# EAGLE design LEDboard (EAGLE 6.4)
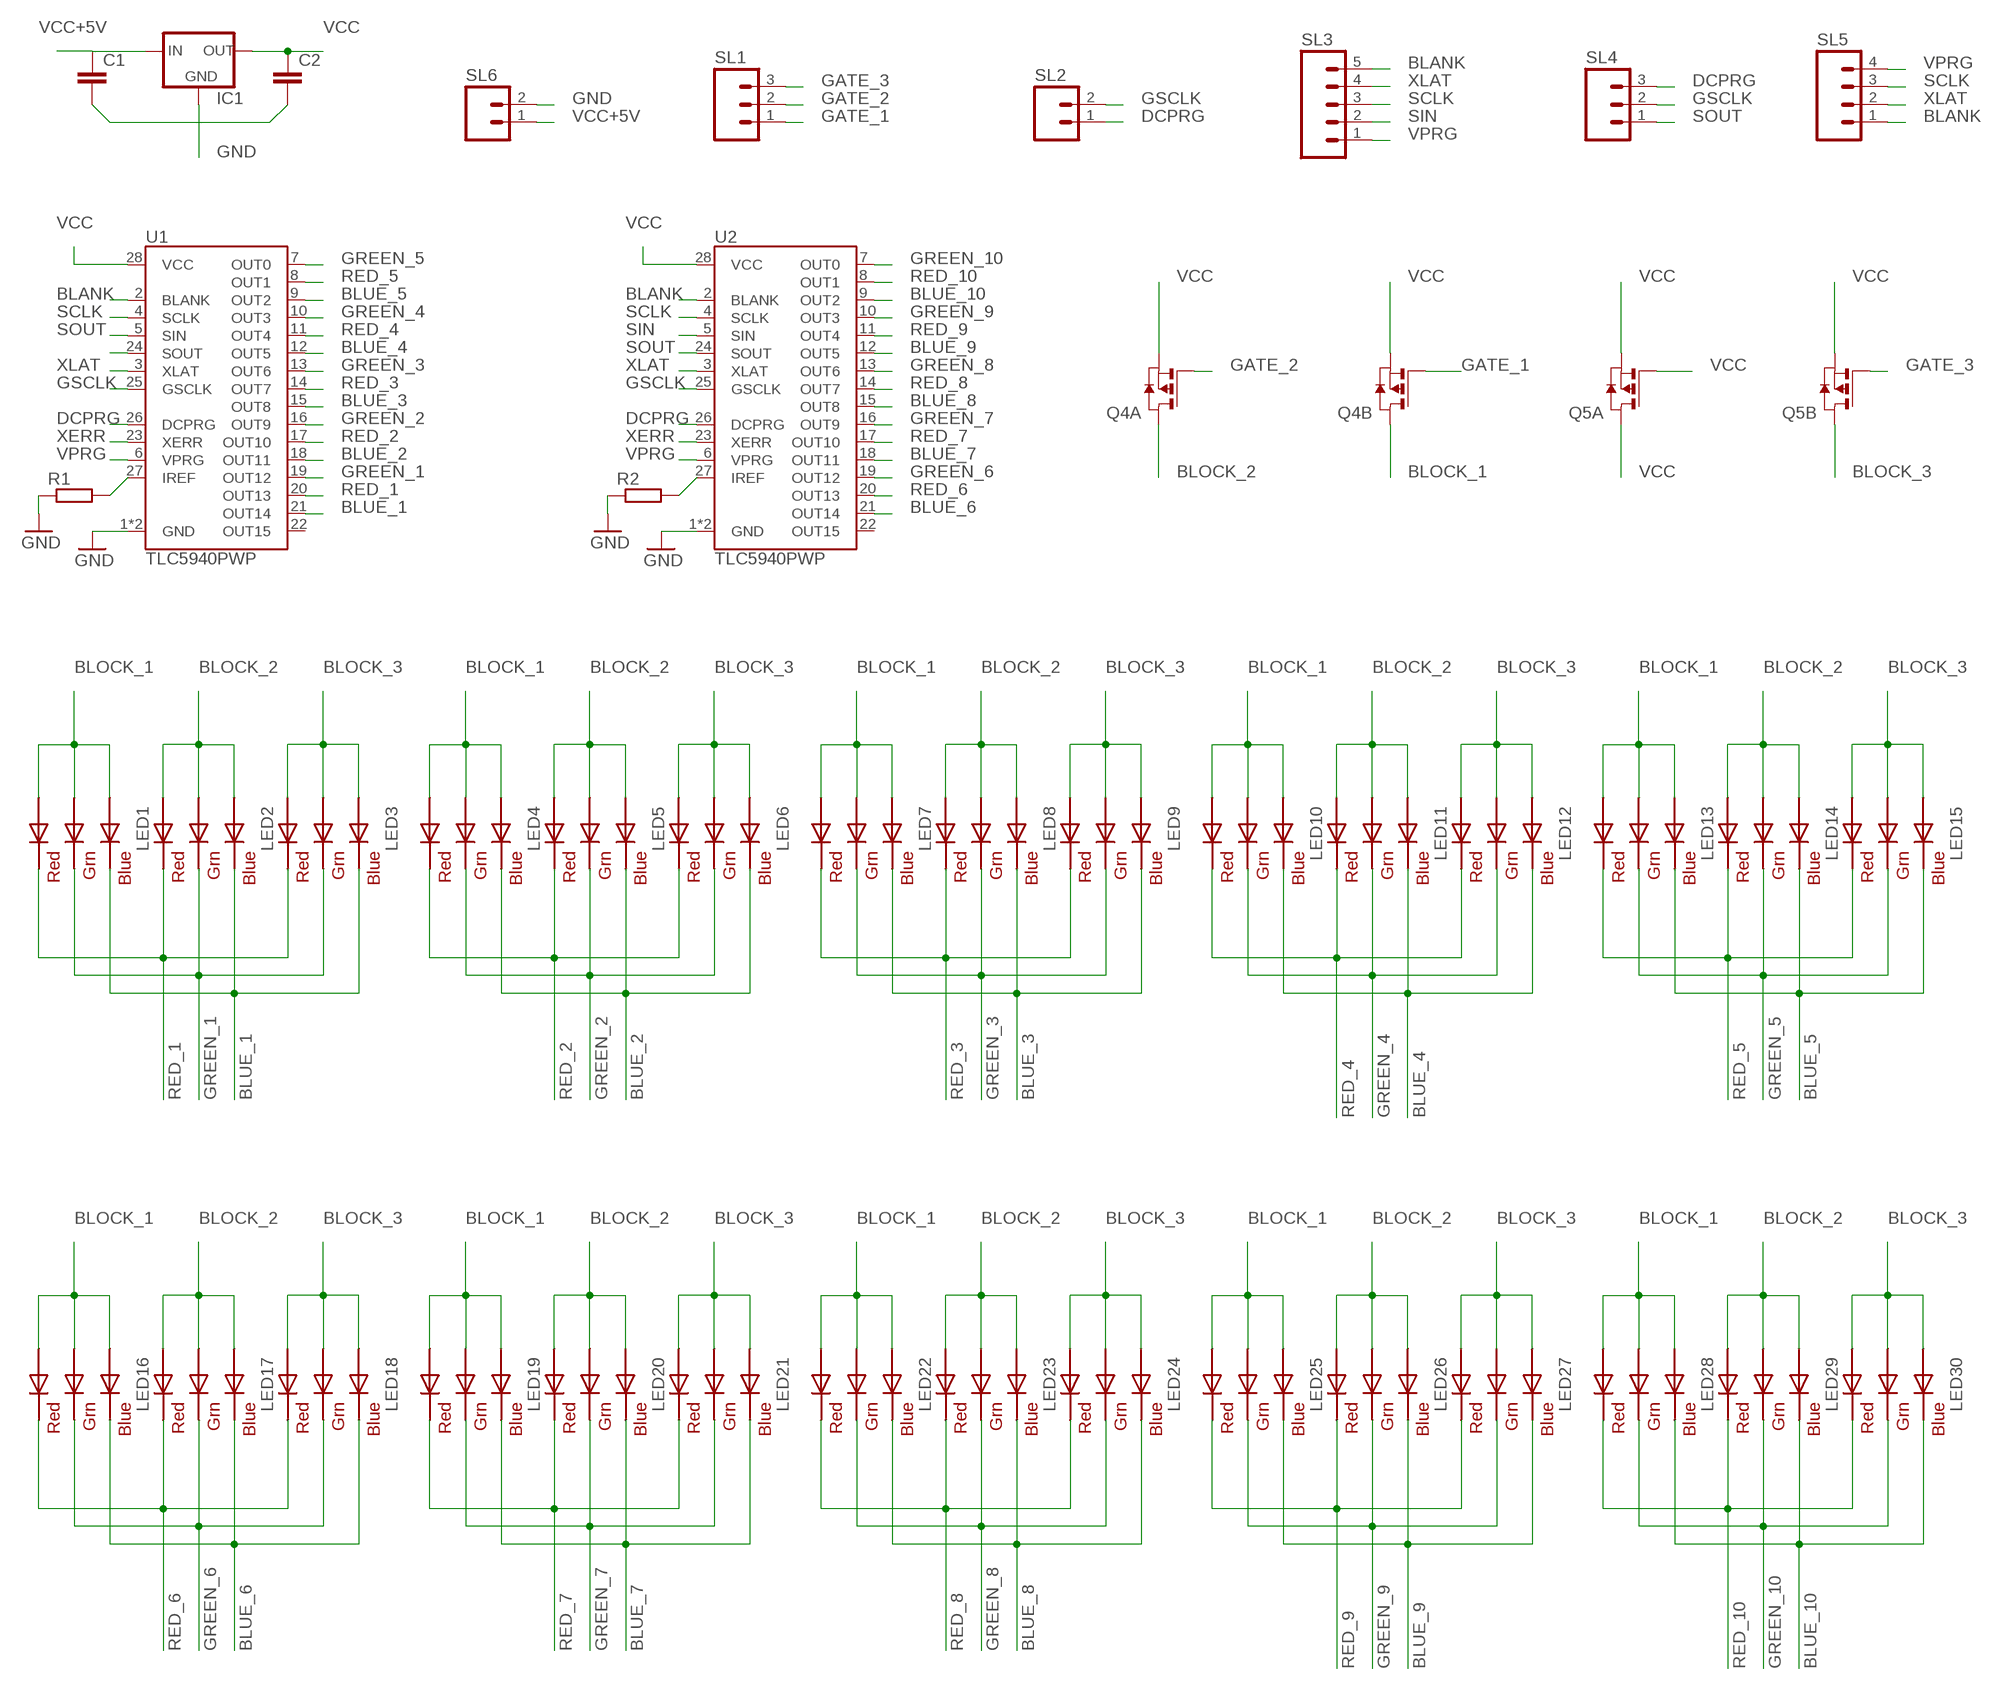
[diagram p0: schematic, sheet 1]

## Parts
C1  C-EU050-025X075  [C050-025X075]
C2  C-EU050-025X075  [C050-025X075]
IC1  78XXL  [78XXL]
LED1  RGBLED5050  [RGBLED5050]
LED2  RGBLED5050  [RGBLED5050]
LED3  RGBLED5050  [RGBLED5050]
LED4  RGBLED5050  [RGBLED5050]
LED5  RGBLED5050  [RGBLED5050]
LED6  RGBLED5050  [RGBLED5050]
LED7  RGBLED5050  [RGBLED5050]
LED8  RGBLED5050  [RGBLED5050]
LED9  RGBLED5050  [RGBLED5050]
LED10  RGBLED5050  [RGBLED5050]
LED11  RGBLED5050  [RGBLED5050]
LED12  RGBLED5050  [RGBLED5050]
LED13  RGBLED5050  [RGBLED5050]
LED14  RGBLED5050  [RGBLED5050]
LED15  RGBLED5050  [RGBLED5050]
LED16  RGBLED5050  [RGBLED5050]
LED17  RGBLED5050  [RGBLED5050]
LED18  RGBLED5050  [RGBLED5050]
LED19  RGBLED5050  [RGBLED5050]
LED20  RGBLED5050  [RGBLED5050]
LED21  RGBLED5050  [RGBLED5050]
LED22  RGBLED5050  [RGBLED5050]
LED23  RGBLED5050  [RGBLED5050]
LED24  RGBLED5050  [RGBLED5050]
LED25  RGBLED5050  [RGBLED5050]
LED26  RGBLED5050  [RGBLED5050]
LED27  RGBLED5050  [RGBLED5050]
LED28  RGBLED5050  [RGBLED5050]
LED29  RGBLED5050  [RGBLED5050]
LED30  RGBLED5050  [RGBLED5050]
Q4  PN_MOSFET-SO8  [SO8]
Q5  PN_MOSFET-SO8  [SO8]
R1  R-EU_M1406  [M1406]
R2  R-EU_M1406  [M1406]
SL1  M03  [03P]
SL2  M02  [02P]
SL3  M05  [05P]
SL4  M03  [03P]
SL5  M04  [04P]
SL6  M02  [02P]
U1  TLC5940PWP  [TSSOP28-GROUNDPAD]
U2  TLC5940PWP  [TSSOP28-GROUNDPAD]

## Nets
BLANK: SL3.5 SL5.1 U1.2(BLANK) U2.2(BLANK)
BLOCK_1: LED1.1(GREEN_A) LED1.2(RED_A) LED1.3(BLUE_A) LED4.1(GREEN_A) LED4.2(RED_A) LED4.3(BLUE_A) LED7.1(GREEN_A) LED7.2(RED_A) LED7.3(BLUE_A) LED10.1(GREEN_A) LED10.2(RED_A) LED10.3(BLUE_A) LED13.1(GREEN_A) LED13.2(RED_A) LED13.3(BLUE_A) LED16.1(GREEN_A) LED16.2(RED_A) LED16.3(BLUE_A) LED19.1(GREEN_A) LED19.2(RED_A) LED19.3(BLUE_A) LED22.1(GREEN_A) LED22.2(RED_A) LED22.3(BLUE_A) LED25.1(GREEN_A) LED25.2(RED_A) LED25.3(BLUE_A) LED28.1(GREEN_A) LED28.2(RED_A) LED28.3(BLUE_A) Q4.5(B:D) Q4.6(B:D)
BLOCK_2: LED2.1(GREEN_A) LED2.2(RED_A) LED2.3(BLUE_A) LED5.1(GREEN_A) LED5.2(RED_A) LED5.3(BLUE_A) LED8.1(GREEN_A) LED8.2(RED_A) LED8.3(BLUE_A) LED11.1(GREEN_A) LED11.2(RED_A) LED11.3(BLUE_A) LED14.1(GREEN_A) LED14.2(RED_A) LED14.3(BLUE_A) LED17.1(GREEN_A) LED17.2(RED_A) LED17.3(BLUE_A) LED20.1(GREEN_A) LED20.2(RED_A) LED20.3(BLUE_A) LED23.1(GREEN_A) LED23.2(RED_A) LED23.3(BLUE_A) LED26.1(GREEN_A) LED26.2(RED_A) LED26.3(BLUE_A) LED29.1(GREEN_A) LED29.2(RED_A) LED29.3(BLUE_A) Q4.7(A:D) Q4.8(A:D)
BLOCK_3: LED3.1(GREEN_A) LED3.2(RED_A) LED3.3(BLUE_A) LED6.1(GREEN_A) LED6.2(RED_A) LED6.3(BLUE_A) LED9.1(GREEN_A) LED9.2(RED_A) LED9.3(BLUE_A) LED12.1(GREEN_A) LED12.2(RED_A) LED12.3(BLUE_A) LED15.1(GREEN_A) LED15.2(RED_A) LED15.3(BLUE_A) LED18.1(GREEN_A) LED18.2(RED_A) LED18.3(BLUE_A) LED21.1(GREEN_A) LED21.2(RED_A) LED21.3(BLUE_A) LED24.1(GREEN_A) LED24.2(RED_A) LED24.3(BLUE_A) LED27.1(GREEN_A) LED27.2(RED_A) LED27.3(BLUE_A) LED30.1(GREEN_A) LED30.2(RED_A) LED30.3(BLUE_A) Q5.5(B:D) Q5.6(B:D)
BLUE_1: LED1.4(BLUE_C) LED2.4(BLUE_C) LED3.4(BLUE_C) U1.21(OUT14)
BLUE_2: LED4.4(BLUE_C) LED5.4(BLUE_C) LED6.4(BLUE_C) U1.18(OUT11)
BLUE_3: LED7.4(BLUE_C) LED8.4(BLUE_C) LED9.4(BLUE_C) U1.15(OUT8)
BLUE_4: LED10.4(BLUE_C) LED11.4(BLUE_C) LED12.4(BLUE_C) U1.12(OUT5)
BLUE_5: LED13.4(BLUE_C) LED14.4(BLUE_C) LED15.4(BLUE_C) U1.9(OUT2)
BLUE_6: LED16.4(BLUE_C) LED17.4(BLUE_C) LED18.4(BLUE_C) U2.21(OUT14)
BLUE_7: LED19.4(BLUE_C) LED20.4(BLUE_C) LED21.4(BLUE_C) U2.18(OUT11)
BLUE_8: LED22.4(BLUE_C) LED23.4(BLUE_C) LED24.4(BLUE_C) U2.15(OUT8)
BLUE_9: LED25.4(BLUE_C) LED26.4(BLUE_C) LED27.4(BLUE_C) U2.12(OUT5)
BLUE_10: LED28.4(BLUE_C) LED29.4(BLUE_C) LED30.4(BLUE_C) U2.9(OUT2)
DCPRG: SL2.1 SL4.3 U1.26(DCPRG) U2.26(DCPRG)
GATE_1: Q4.4(B:G) SL1.1
GATE_2: Q4.2(A:G) SL1.2
GATE_3: Q5.4(B:G) SL1.3
GND: C1.2 C2.2 IC1.GND R1.1 R2.1 SL6.2 U1.1(GND) U1.29(GND) U2.1(GND) U2.29(GND)
GREEN_1: LED1.6(GREEN_C) LED2.6(GREEN_C) LED3.6(GREEN_C) U1.19(OUT12)
GREEN_2: LED4.6(GREEN_C) LED5.6(GREEN_C) LED6.6(GREEN_C) U1.16(OUT9)
GREEN_3: LED7.6(GREEN_C) LED8.6(GREEN_C) LED9.6(GREEN_C) U1.13(OUT6)
GREEN_4: LED10.6(GREEN_C) LED11.6(GREEN_C) LED12.6(GREEN_C) U1.10(OUT3)
GREEN_5: LED13.6(GREEN_C) LED14.6(GREEN_C) LED15.6(GREEN_C) U1.7(OUT0)
GREEN_6: LED16.6(GREEN_C) LED17.6(GREEN_C) LED18.6(GREEN_C) U2.19(OUT12)
GREEN_7: LED19.6(GREEN_C) LED20.6(GREEN_C) LED21.6(GREEN_C) U2.16(OUT9)
GREEN_8: LED22.6(GREEN_C) LED23.6(GREEN_C) LED24.6(GREEN_C) U2.13(OUT6)
GREEN_9: LED25.6(GREEN_C) LED26.6(GREEN_C) LED27.6(GREEN_C) U2.10(OUT3)
GREEN_10: LED28.6(GREEN_C) LED29.6(GREEN_C) LED30.6(GREEN_C) U2.7(OUT0)
GSCLK: SL2.2 SL4.2 U1.25(GSCLK) U2.25(GSCLK)
N$9: R2.2 U2.27(IREF)
N$10: R1.2 U1.27(IREF)
RED_1: LED1.5(RED_C) LED2.5(RED_C) LED3.5(RED_C) U1.20(OUT13)
RED_2: LED4.5(RED_C) LED5.5(RED_C) LED6.5(RED_C) U1.17(OUT10)
RED_3: LED7.5(RED_C) LED8.5(RED_C) LED9.5(RED_C) U1.14(OUT7)
RED_4: LED10.5(RED_C) LED11.5(RED_C) LED12.5(RED_C) U1.11(OUT4)
RED_5: LED13.5(RED_C) LED14.5(RED_C) LED15.5(RED_C) U1.8(OUT1)
RED_6: LED16.5(RED_C) LED17.5(RED_C) LED18.5(RED_C) U2.20(OUT13)
RED_7: LED19.5(RED_C) LED20.5(RED_C) LED21.5(RED_C) U2.17(OUT10)
RED_8: LED22.5(RED_C) LED23.5(RED_C) LED24.5(RED_C) U2.14(OUT7)
RED_9: LED25.5(RED_C) LED26.5(RED_C) LED27.5(RED_C) U2.11(OUT4)
RED_10: LED28.5(RED_C) LED29.5(RED_C) LED30.5(RED_C) U2.8(OUT1)
SCLK: SL3.3 SL5.3 U1.4(SCLK) U2.4(SCLK)
SIN: SL3.2 U2.5(SIN)
SOUT: SL4.1 U1.5(SIN) U1.24(SOUT) U2.24(SOUT)
VCC: C2.1 IC1.OUT Q4.1(A:S) Q4.3(B:S) Q5.1(A:S) Q5.2(A:G) Q5.3(B:S) Q5.7(A:D) Q5.8(A:D) U1.28(VCC) U2.28(VCC)
VCC+5V: C1.1 IC1.IN SL6.1
VPRG: SL3.1 SL5.4 U1.6(VPRG) U2.6(VPRG)
XERR: U1.23(XERR) U2.23(XERR)
XLAT: SL3.4 SL5.2 U1.3(XLAT) U2.3(XLAT)
Unconnected: U1.22(OUT15) U2.22(OUT15)

## Library data of the parts
C1 C2 = rcl:C-EU: CAPACITOR, European symbol
IC1 = v-reg:78XXL: VOLTAGE REGULATOR
LED1-LED30 = adafruit:RGBLED: For 5050 RGB LEDs, the order of the LEDs may vary from one manufacturer to another!
Q4 Q5 = zetex:PN_MOSFET-: DUAL N AND P-CHANNEL ENHANCEMENT MODE MOSFET source ZXMD63C02.pdf from http://www.zetex.com/; OC_FARNELL: unknown; OC_NEWARK: unknown
R1 R2 = resistor:R-EU_: RESISTOR, European symbol
SL1 SL4 = con-amp-quick:M03: AMP QUICK CONNECTOR; OC_FARNELL: unknown; OC_NEWARK: unknown
SL2 SL6 = con-amp-quick:M02: AMP QUICK CONNECTOR; OC_FARNELL: unknown; OC_NEWARK: unknown
SL3 = con-amp-quick:M05: AMP QUICK CONNECTOR; OC_FARNELL: unknown; OC_NEWARK: unknown
SL5 = con-amp-quick:M04: AMP QUICK CONNECTOR; OC_FARNELL: unknown; OC_NEWARK: unknown
U1 U2 = SparkFun-DigitalIC:TLC5940: 16-channel LED Driver with Dot Correction and Grayscale PWM Control The TLC5940 is a 16-channel, constant-current sink LED driver. Each channel has an individually adjustable 4096-step grayscale PWM brightness control and a 64-step, constant-current sink (dot correction). The dot correction adjusts the brightness variations between LED channels and other LED drivers. The dot correction data is stored in an integrated EEPROM. Both grayscale control and dot correction are accessible via a serial interface. A single external resistor sets the maximum current value of all 16 channels. Packages: 28-pin HTSSOP 32-pin 5x5mm QFN 28-pin DIP

## Board
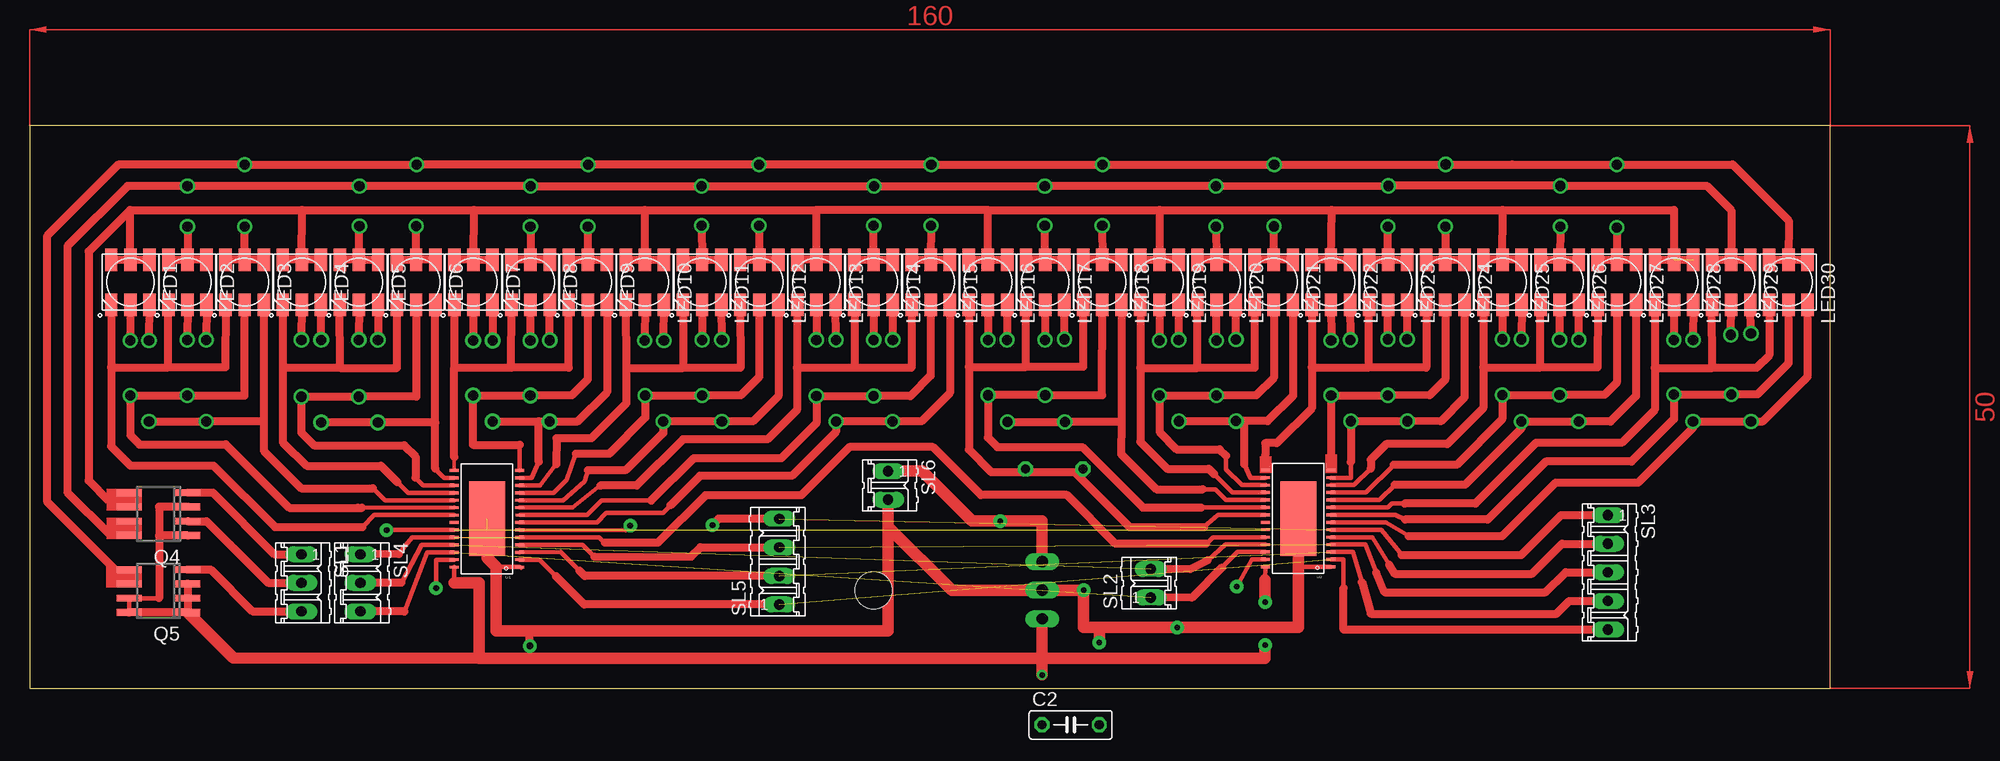
[diagram p1: board, top side]
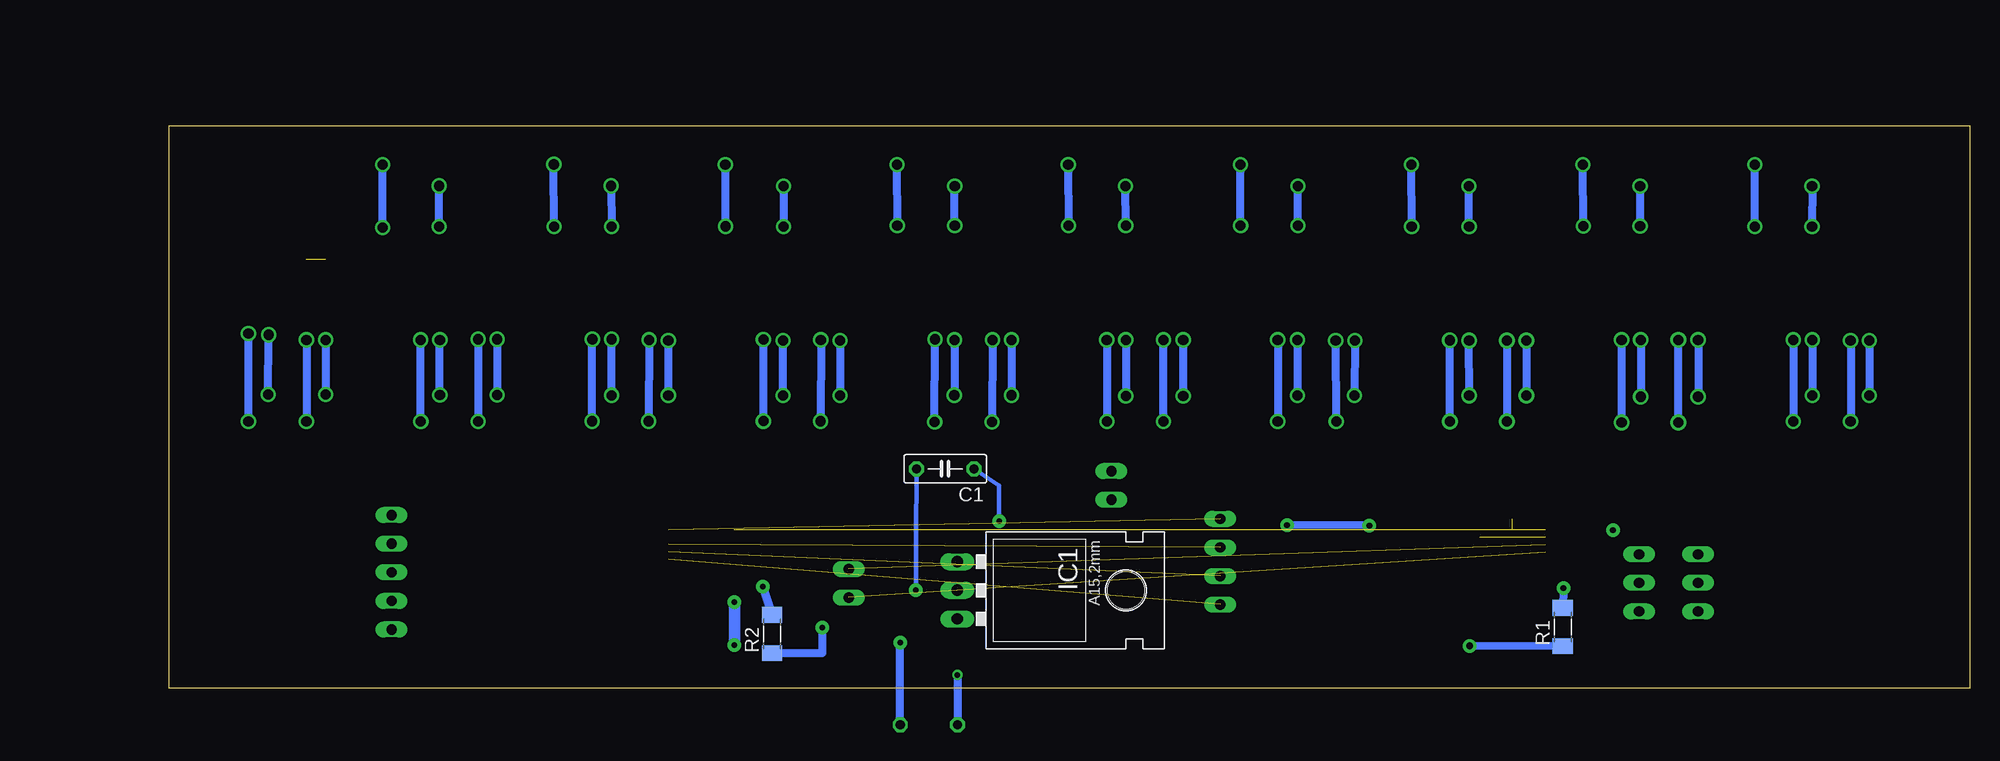
[diagram p2: board, bottom side, seen from below]

Size 160 x 50 mm. Coordinates in mm from the lower left corner, seen from the top.
Outline: 0,0 160,0 160,50 0,50 0,0
Copper layers (1*16): Top 0.035mm / dielectric 1.5mm / Bottom 0.035mm
Design rules "default *": minimum track width 0.002540625mm, minimum drill 24mil, track to track 8mil, track to pad 8mil, pad to pad 8mil, via to via 8mil, smd to smd 8mil, copper to edge 40mil, drill to drill 8mil, minimum pad ring 10mil, minimum via ring 8mil, stop-mask expansion 4mil, vias tented up to drill 0mil, thermal gap 10mil

### Footprints (pad centres in the part's own frame; a part is rotated, then mirrored left to right if it is on the bottom)
C050-025X075 = drill 0.813 octagon: 1 -2.54,0; 2 2.54,0
78XXL = drill 1.016 long: GND 0,-3.81; IN -2.54,-3.81; OUT 2.54,-3.81 | hole 3.302: 0,11.176
RGBLED5050 = smd 2 x 1.1: 1 -2,1.7; 2 -2,0; 3 -2,-1.7; 4 2,-1.7; 5 2,0; 6 2,1.7
SO8 = smd 0.6 x 2.2: 1 -1.905,-2.6; 2 -0.635,-2.6; 3 0.635,-2.6; 4 1.905,-2.6; 5 1.905,2.6; 6 0.635,2.6; 7 -0.635,2.6; 8 -1.905,2.6
M1406 = smd 1.4 x 1.8: 1 -1.7,0; 2 1.7,0
03P = drill 0.914 long: 1 -2.54,0; 2 0,0; 3 2.54,0
02P = drill 0.914 long: 1 -1.27,0; 2 1.27,0
05P = drill 0.914 long: 1 -5.08,0; 2 -2.54,0; 3 0,0; 4 2.54,0; 5 5.08,0
04P = drill 0.914 long: 1 -3.81,0; 2 -1.27,0; 3 1.27,0; 4 3.81,0
TSSOP28-GROUNDPAD = smd 0.8 x 0.25: 1 -2.921,4.298; 2 -2.921,3.637; 3 -2.921,2.977; 4 -2.921,2.317; 5 -2.921,1.656; 6 -2.921,0.996; 7 -2.921,0.335; 8 -2.927,-0.325; 9 -2.921,-0.985; 10 -2.921,-1.646; 11 -2.921,-2.306; 12 -2.921,-2.967; 13 -2.921,-3.627; 14 -2.921,-4.287; 15 2.921,-4.287; 16 2.921,-3.627; 17 2.921,-2.967; 18 2.921,-2.306; 19 2.921,-1.646; 20 2.921,-0.985; 21 2.927,-0.325; 22 2.921,0.335; 23 2.921,0.996; 24 2.921,1.656; 25 2.921,2.317; 26 2.921,2.977; 27 2.921,3.637; 28 2.921,4.298 | smd 3.2 x 6.6: 29 0,0.005

### Placement (x,y rotation side)
C1  91.04,19.52 180 bottom
C2  92.5,-3.24 0 top  (outside the outline)
IC1  86.16,8.72 270 bottom
LED1  8.95,36.11 270 top
LED2  14.03,36.11 270 top
LED3  19.11,36.11 270 top
LED4  24.19,36.11 270 top
LED5  29.27,36.11 270 top
LED6  34.35,36.11 270 top
LED7  39.43,36.11 270 top
LED8  44.51,36.11 270 top
LED9  49.59,36.11 270 top
LED10  54.67,36.11 270 top
LED11  59.75,36.11 270 top
LED12  64.83,36.11 270 top
LED13  69.91,36.11 270 top
LED14  74.99,36.11 270 top
LED15  80.07,36.11 270 top
LED16  85.15,36.11 270 top
LED17  90.23,36.11 270 top
LED18  95.31,36.11 270 top
LED19  100.39,36.11 270 top
LED20  105.47,36.11 270 top
LED21  110.55,36.11 270 top
LED22  115.63,36.11 270 top
LED23  120.71,36.11 270 top
LED24  125.79,36.11 270 top
LED25  130.87,36.11 270 top
LED26  135.95,36.11 270 top
LED27  141.03,36.11 270 top
LED28  146.11,36.11 270 top
LED29  151.19,36.11 270 top
LED30  156.27,36.11 270 top
Q4  11.46,15.5 90 top
Q5  11.44,8.66 90 top
R1  36.18,5.46 90 bottom
R2  106.44,4.84 90 bottom
SL1  24.14,9.38 270 top
SL2  99.62,9.34 90 top
SL3  140.24,10.32 270 top
SL4  29.4,9.38 270 top
SL5  66.6,11.26 90 top
SL6  76.28,18.04 270 top
U1  40.64,15.08 180 top
U2  112.72,15.1 180 top

### Tracks (layer width: path | path; a pad name or v marks a point on that pad's centre or on a via)
BLANK  (1 unrouted)
  Top 0.4: U2.2 116.74,11.46 116.74,8.92 | U1.2 45.3,11.44 46.76,9.98
  Top 0.7: SL5.1 49.29,7.47 46.76,9.98 | SL3.5 116.74,5.24 116.74,8.92
BLOCK_1  (1 unrouted)
  Top 0.4: 7,16.72 8.86,16.72 | 8.86,16.72 Q4.5 | 8.86,16.72 Q4.6
  Top 0.7: LED7.2 LED7.3 | LED10.3 LED10.2 | 130.9,42.53 146.11,42.53 LED28.2 | LED4.1 LED4.2 | LED4.2 LED4.3 | 39.46,42.53 54.68,42.53 | 54.68,42.53 69.9,42.53 | LED28.3 LED28.1 | LED25.1 LED25.2 | LED25.2 LED25.3 | 8.94,42.53 24.2,42.53 | LED16.3 LED16.2 | LED16.2 LED16.1 | LED19.3 LED19.2 | LED13.1 LED13.2 | LED13.2 LED13.3 | LED13.2 69.9,42.53 | 85.15,42.53 69.9,42.53 | LED19.1 LED19.2 | 100.4,42.53 115.7,42.53 | LED16.2 85.15,42.53 | 85.15,42.53 100.4,42.53 | 100.4,42.53 LED19.2 | LED22.2 LED22.1 | LED22.2 LED22.3 | LED22.2 115.7,42.53 | 115.7,42.53 130.9,42.53 | LED1.3 LED1.2 | LED4.2 24.2,42.53 | LED25.2 130.9,42.53 | LED1.2 8.94,42.53 | LED1.2 LED1.1 | 39.46,42.53 LED7.2 | LED7.2 LED7.1 | LED10.2 54.68,42.53 | LED10.2 LED10.1 | 24.2,42.53 39.46,42.53 | 8.94,42.53 5.25,38.84 5.25,18.47 7,16.72
BLOCK_2  (via drill 0.9 pad 1)
  Top 0.4: 7.06,13.74 8.86,14.18 | 8.86,14.18 Q4.7 | 8.86,14.18 Q4.8
  Top 0.7: v14.02,44.65 v29.3,44.64 v44.51,44.63 v59.7,44.64 v75.02,44.65 v90.2,44.64 v105.42,44.65 v120.72,44.67 v136.02,44.67 149.01,44.67 151.18,42.5 LED29.2 | LED2.3 LED2.2 | LED2.1 LED2.2 | LED29.3 LED29.2 | LED29.2 LED29.1 | LED26.2 LED26.1 | LED5.2 LED5.1 | LED11.2 LED11.1 | v14.03,41.05 LED2.2 | LED5.2 LED5.3 | LED17.2 LED17.3 | LED17.2 LED17.1 | LED17.2 v90.2,41.15 | LED14.3 LED14.2 | LED14.2 LED14.1 | LED14.2 v75,41.15 | LED20.2 LED20.3 | LED20.1 LED20.2 | v105.4,41.05 LED20.2 | LED23.3 LED23.2 | LED23.2 LED23.1 | LED23.2 v120.7,41.05 | LED8.1 LED8.2 | LED8.2 LED8.3 | LED11.3 LED11.2 | LED26.3 LED26.2 | LED5.2 v29.3,41.1 | v44.5,41.05 LED8.2 | v59.7,41.15 LED11.2 | v136,41.05 LED26.2 | 14,44.62 v14.02,44.65 | v14.02,44.65 8.71,44.65 3.36,39.3 3.36,17.44 7.06,13.74
  Bottom 0.7: v14.02,44.65 v14.03,41.05 | v59.7,41.15 v59.7,44.64 | v29.3,41.1 v29.3,44.64 | v44.5,41.05 v44.51,44.63 | v90.2,41.15 v90.2,44.64 | v75,41.15 v75.02,44.65 | v105.42,44.65 v105.4,41.05 | v120.72,44.67 v120.7,41.05 | v136,41.05 v136.02,44.67
BLOCK_3  (via drill 0.9 pad 1)
  Top 0.4: Q5.6 Q5.5
  Top 0.7: LED3.2 LED3.3 | LED30.3 LED30.2 | LED30.2 LED30.1 | LED3.1 LED3.2 | LED6.1 LED6.2 | LED27.2 LED27.1 | LED9.3 LED9.2 | LED12.1 LED12.2 | LED18.1 LED18.2 | LED18.2 LED18.3 | LED24.3 LED24.2 | LED15.3 LED15.2 | LED15.2 LED15.1 | v95.3,41.15 LED18.2 | LED3.2 v19.1,41.05 | v80.1,41.15 LED15.2 | LED21.1 LED21.2 | LED21.2 LED21.3 | LED21.2 v110.56,41.07 | LED6.3 LED6.2 | LED9.2 LED9.1 | LED12.3 LED12.2 | LED24.2 LED24.1 | LED27.3 LED27.2 | LED6.2 v34.35,41.1 | v49.6,41.05 LED9.2 | v64.8,41.15 LED12.2 | v125.8,41.05 LED24.2 | v141.04,40.97 LED27.2 | LED30.2 156.3,41.58 151.32,46.56 v141.04,46.56 131.72,46.57 v125.82,46.57 v110.58,46.55 v95.32,46.55 v80.12,46.55 v64.82,46.55 v49.62,46.55 v34.38,46.55 v19.12,46.55 7.87,46.55 1.58,40.24 1.58,16.55 Q5.6
  Bottom 0.7: v34.35,41.1 v34.38,46.55 | v49.6,41.05 v49.62,46.55 | v64.8,41.15 v64.82,46.55 | v95.3,41.15 v95.32,46.55 | v125.8,41.05 v125.82,46.57 | v19.1,41.05 v19.12,46.55 | v80.12,46.55 v80.1,41.15 | v110.56,41.07 v110.58,46.55 | v141.04,40.97 v141.04,46.56
BLUE_1
  Top 0.4: U1.21 30.62,15.4 29.58,14.34
  Top 0.7: LED1.4 7.25,28.53 | 12.32,28.53 LED2.4 | LED3.4 17.4,28.53 12.32,28.53 | 7.25,28.53 12.32,28.53 | 29.58,14.34 21.8,14.34 16.32,19.8 8.96,19.8 7.25,21.51 7.25,28.53
BLUE_2
  Top 0.4: U1.18 33.61,17.39 32.66,18.34
  Top 0.7: LED4.4 22.5,28.48 | LED6.4 32.65,28.48 27.6,28.48 | 27.6,28.48 22.5,28.48 | 27.6,28.48 LED5.4 | 22.5,28.48 22.5,21.88 24.62,19.78 31.22,19.78 32.66,18.34
BLUE_3
  Top 0.3: 37.74,20.55 37.72,20.53 U1.15
  Top 0.7: LED7.4 37.74,28.51 | LED9.4 47.9,28.52 42.8,28.51 | 37.74,28.51 42.8,28.51 | 42.8,28.51 LED8.4 | 37.74,20.55 37.74,28.51
BLUE_4
  Top 0.4: U1.12 45.37,18.05 46.8,19.94
  Top 0.7: LED10.4 53,28.48 | 53,28.48 58.05,28.48 | LED11.4 58.05,28.48 | LED12.4 63.15,28.48 58.05,28.48 | 53,28.48 53,25.34 49.9,22.22 46.82,22.22 46.8,19.94
BLUE_5
  Top 0.4: U1.9 48.27,16.07 50.7,18.02
  Top 0.7: LED13.4 68.19,28.48 | 73.3,28.48 68.19,28.48 | LED15.4 78.35,28.48 73.3,28.48 | LED14.4 73.3,28.48 | 68.19,28.48 68.19,24.75 65.56,22.14 58.06,22.14 53.94,18.02 50.7,18.02
BLUE_6
  Top 0.4: U2.21 105.61,15.43 104.36,14.34
  Top 0.7: LED16.4 83.45,28.58 | 83.45,28.58 88.55,28.58 | 88.55,28.58 LED17.4 | LED18.4 93.6,28.58 88.55,28.58 | 83.45,28.58 83.45,21.23 85.44,19.24 92.86,19.24 97.74,14.34 104.36,14.34
BLUE_7
  Top 0.4: 105.26,19.04 106.89,17.41 U2.18
  Top 0.7: LED19.4 98.7,28.5 | LED21.4 108.85,28.49 103.77,28.5 | 98.7,28.5 103.77,28.5 | 103.77,28.5 LED20.4 | 98.7,28.5 98.7,21.92 101.1,19.52 104.78,19.52 105.26,19.04
BLUE_8
  Top 0.3: 109.8,20.74 U2.15
  Top 0.7: LED22.4 113.92,28.53 | 113.92,28.53 119,28.53 | 119,28.53 LED23.4 | LED24.4 124.1,28.52 119,28.53 | 113.92,28.53 113.92,24.9 110.82,21.8 109.8,21.8 109.8,20.74
BLUE_9
  Top 0.4: U2.12 117.69,18.07 119.16,19.54
  Top 0.7: LED25.4 129.15,28.53 | 129.15,28.53 134.25,28.53 | 134.25,28.53 LED26.4 | LED27.4 139.3,28.53 134.25,28.53 | 129.15,28.53 129.15,24.91 125.96,21.72 120.54,21.72 119.16,20.34 119.16,19.54
BLUE_10
  Top 0.4: U2.9 120.7,16.09 121.06,16.44 122.16,16.44
  Top 0.7: LED28.4 144.4,28.48 | 144.4,28.48 149.5,28.48 | 149.5,28.48 LED29.4 | 144.4,28.48 144.4,24.76 141.46,21.82 133.84,21.82 128.48,16.44 122.16,16.44 | LED30.4 154.57,29.61 153.44,28.48 149.5,28.48
DCPRG  (1 unrouted)
  Top 0.4: U2.26 107.32,12.12 105.96,10.74 | U1.26 35.3,12.1 33.32,6.84
  Top 0.7: 33.32,6.84 SL4.3 | 105.96,10.74 103.27,8.05 SL2.1
GATE_1
  Top 0.7: Q4.4 16.27,17.41 21.75,11.93 SL1.1
GATE_2
  Top 0.7: Q4.2 15.71,14.87 21.19,9.39 SL1.2
GATE_3
  Top 0.7: Q5.4 16.07,10.56 19.78,6.86 SL1.3
GND  (via drill 0.5 pad 1.2, 0.6 pad 1.2)  (1 unrouted)
  Top 0.3: 43.68,10.66 U1.1
  Top 0.4: 41.44,10.78 U1.1 | 40.64,14.08 40.64,14.04 40.64,13.48 | U2.1 112.72,10.8 112.72,11.76
  Top 0.406: 40.64,11.96 40.64,13.48 40.64,13.88
  Top 0.7: 112.72,11.76 U2.29 | v44.44,3.78 44.44,5.1
  Top 1: 40.64,14.04 40.64,11.58 41.44,10.78 41.44,5.1 44.44,5.1 76.28,5.1 76.28,14.36 | 112.72,11.76 112.72,5.42 v101.96,5.42 95.04,5.42 | SL6.2 76.28,14.36 | 76.28,14.36 81.94,8.7 IC1.GND v93.66,8.72 93.66,5.42 95.04,5.42 | v95.04,4.06 95.04,5.42
  Bottom 0.406: C1.2 93.66,13.3 v93.66,8.72
  Bottom 0.7: R2.1 101.96,3.14 v101.96,5.42 | R1.1 v44.44,3.78 | C2.2 v95.04,4.06
GREEN_1  (via drill 0.9 pad 1)
  Top 0.4: U1.19 31.58,16.73 30.52,17.78
  Top 0.7: LED2.6 v15.7,30.98 | LED3.6 20.8,23.73 | LED1.6 v10.6,30.93 | v10.6,23.73 v15.7,23.73 20.8,23.73 | 20.8,23.73 20.8,21.12 24.14,17.78 30.52,17.78
  Bottom 0.7: v15.7,30.98 v15.7,23.73 | v10.6,30.93 v10.6,23.73
GREEN_2  (via drill 0.9 pad 1.4)
  Top 0.4: U1.16 36.83,18.71 36.05,19.51
  Top 0.7: LED5.6 v30.95,30.98 | v25.9,23.63 v30.95,23.63 36.05,23.63 | v25.9,30.98 LED4.6 | 36.05,23.63 LED6.6 | 36.05,19.51 36.05,23.63
  Bottom 0.7: v30.95,30.98 v30.95,23.63 | v25.9,23.63 v25.9,30.98
GREEN_3  (via drill 0.9 pad 1.4)
  Top 0.4: U1.13 44.59,18.71 45.24,20.14
  Top 0.7: LED7.6 v41.15,30.93 | v41.15,23.73 45.24,23.73 | 45.24,23.73 v46.21,23.73 48.71,23.73 51.29,26.31 LED9.6 | v46.22,30.94 LED8.6 | 45.24,20.14 45.24,23.73
  Bottom 0.7: v41.15,30.93 v41.15,23.73 | v46.21,23.73 v46.22,30.94
GREEN_4  (via drill 0.9 pad 1)
  Top 0.4: U1.10 47.39,16.73 49.3,18.4 49.62,19.4
  Top 0.7: LED11.6 v61.5,30.98 | v56.35,30.93 LED10.6 | LED12.6 66.53,25.99 64.28,23.74 v61.5,23.73 v56.3,23.73 56.3,22.7 53.02,19.42 49.62,19.4
  Bottom 0.7: v61.5,30.98 v61.5,23.73 | v56.3,23.73 v56.35,30.93
GREEN_5  (via drill 0.9 pad 1)
  Top 0.4: U1.7 50.41,14.74 51.22,15.62 56.28,15.62 56.94,16.28
  Top 0.7: LED14.6 v76.69,30.98 | v71.65,30.98 LED13.6 | 56.94,16.28 59.56,18.9 67.74,18.9 71.65,22.81 v71.65,23.73 v76.68,23.73 79.24,23.74 81.77,26.27 LED15.6
  Bottom 0.7: v76.69,30.98 v76.68,23.73 | v71.65,23.73 v71.65,30.98
GREEN_6  (via drill 0.9 pad 1)
  Top 0.4: U2.19 106.31,16.75 105.36,17.7 104.24,17.7
  Top 0.7: LED18.6 97.01,23.68 | 97.01,23.68 v91.98,23.68 v86.9,23.68 | v91.95,31.03 LED17.6 | LED16.6 v86.85,30.98 | 97.01,23.68 96.99,20.83 100.14,17.7 104.24,17.7
  Bottom 0.7: v91.98,23.68 v91.95,31.03 | v86.85,30.98 v86.9,23.68
GREEN_7  (via drill 0.9 pad 1)
  Top 0.4: U2.16 108.49,18.73 107.92,19.92
  Top 0.7: LED19.6 v102.1,30.98 | v102.13,23.75 v107.2,23.75 107.94,23.76 | v107.2,31.01 LED20.6 | LED21.6 112.25,26.01 110,23.76 107.94,23.76 | 107.94,23.76 | 107.92,19.92 107.94,23.76
  Bottom 0.7: v102.1,30.98 v102.13,23.75 | v107.2,23.75 v107.2,31.01
GREEN_8  (via drill 0.9 pad 1)
  Top 0.4: U2.13 117.39,18.73 117.39,20.09
  Top 0.7: LED22.6 v117.35,30.98 | 121.88,23.75 v117.39,23.75 117.39,20.09 | 121.88,23.75 v122.41,23.75 | v122.4,31.03 LED23.6 | LED24.6 127.49,25.87 125.38,23.74 121.88,23.75
  Bottom 0.7: v117.35,30.98 v117.39,23.75 | v122.41,23.75 v122.4,31.03
GREEN_9  (via drill 0.9 pad 1)
  Top 0.4: U2.10 119.95,16.75 121.3,18.09
  Top 0.7: v137.65,30.98 LED26.6 | LED25.6 v132.55,31.03 | LED27.6 142.73,25.99 140.46,23.72 v137.64,23.73 v132.55,23.73 132.55,23.11 127.54,18.1 121.3,18.09
  Bottom 0.7: v137.64,23.73 v137.65,30.98 | v132.55,31.03 v132.55,23.73
GREEN_10  (via drill 0.9 pad 1)
  Top 0.4: U2.7 120.5,14.77 122.54,13.54
  Top 0.7: LED28.6 v147.8,30.98 | v152.95,31.53 LED29.6 | LED30.6 157.97,27.69 154.02,23.74 v152.95,23.73 v147.8,23.73 147.8,23.16 142.9,18.28 135.58,18.28 130.84,13.54 122.54,13.54
  Bottom 0.7: v147.8,30.98 v147.8,23.73 | v152.95,23.73 v152.95,31.53
GSCLK  (1 unrouted)
  Top 0.4: U2.25 106.24,12.78 104.68,11.38 | U1.25 34.82,12.76 33.04,9.4
  Top 0.7: 33.04,9.4 SL4.2 | 104.68,11.38 103.11,10.59 SL2.2
N$9  (via drill 0.5 pad 1.2)
  Top 0.4: U2.27 108.62,11.46 v107.26,9.06
  Bottom 0.7: v107.26,9.06 R2.2
N$10  (via drill 0.5 pad 1.2)
  Top 0.4: U1.27 36.12,11.44 v36.12,8.9
  Bottom 0.7: v36.12,8.9 R1.2
RED_1  (via drill 0.9 pad 1)
  Top 0.4: U1.20 29.16,16.06
  Top 0.7: LED1.5 v8.95,30.93 | LED3.5 19.11,26.03 v14,26.03 v8.95,26.03 8.95,22.51 9.78,21.68 17.44,21.7 23.08,16.06 29.16,16.06 29.54,16.06 | LED2.5 v14,30.98
  Bottom 0.7: v8.95,30.93 v8.95,26.03 | v14,30.98 v14,26.03
RED_2  (via drill 0.9 pad 1.4)
  Top 0.4: U1.17 34.97,18.05 34.3,18.72
  Top 0.7: LED4.5 v24.15,30.98 | LED6.5 34.35,25.93 v29.25,25.93 v24.15,25.93 24.15,22.73 25.28,21.6 33.3,21.6 34.3,20.6 34.3,18.72 | LED5.5 v29.25,30.98
  Bottom 0.7: v24.15,30.98 v24.15,25.93 | v29.25,30.98 v29.25,25.93
RED_3  (via drill 0.9 pad 1.4)
  Top 0.4: U1.14 43.56,21.66
  Top 0.7: LED7.5 v39.4,30.93 | v44.5,30.93 LED8.5 | LED9.5 49.59,27.47 48.16,26.04 v44.49,26.03 v39.4,26.03 39.4,21.66 43.56,21.66
  Bottom 0.7: v39.4,30.93 v39.4,26.03 | v44.49,26.03 v44.5,30.93
RED_4  (via drill 0.9 pad 1)
  Top 0.4: U1.11 46.57,17.39 47.72,18.54 48.52,20.84
  Top 0.7: LED10.5 v54.65,30.93 | LED11.5 v59.75,30.98 | LED12.5 64.83,27.69 63.18,26.04 v59.75,26.03 v54.7,26.03 54.7,24.06 51.5,20.84 48.52,20.84
  Bottom 0.7: v54.65,30.93 v54.7,26.03 | v59.75,30.98 v59.75,26.03
RED_5  (via drill 0.9 pad 1)
  Top 0.4: U1.8 49.52,15.4 50.82,16.7 55.24,16.7
  Top 0.7: LED13.5 v69.9,30.98 | LED14.5 v75,30.98 | 55.24,16.7 59,20.46 66.78,20.46 69.9,23.58 v69.9,25.98 v75,25.98 78.26,25.98 80.07,27.79 LED15.5
  Bottom 0.7: v69.9,30.98 v69.9,25.98 | v75,30.98 v75,25.98
RED_6  (via drill 0.9 pad 1)
  Top 0.4: U2.20 104.12,16.08
  Top 0.7: LED16.5 v85.15,30.98 | LED17.5 v90.22,30.98 | LED18.5 95.3,26.06 v90.24,26.06 v85.15,26.06 85.15,22.29 85.98,21.46 93.54,21.46 98.92,16.08 104.12,16.08
  Bottom 0.7: v85.15,30.98 v85.15,26.06 | v90.22,30.98 v90.24,26.06
RED_7  (via drill 0.9 pad 1)
  Top 0.4: U2.17 107.71,18.07 106.3,19.48 106.3,20.7
  Top 0.7: LED19.5 v100.4,30.93 | v105.45,30.93 LED20.5 | LED21.5 110.55,27.61 108.98,26.04 v105.45,26.04 v100.4,26.03 100.4,22.8 101.92,21.26 105.74,21.26 106.3,20.7
  Bottom 0.7: v100.4,30.93 v100.4,26.03 | v105.45,26.04 v105.45,30.93
RED_8  (via drill 0.9 pad 1)
  Top 0.3: 115.65,20.63 U2.14
  Top 0.7: LED22.5 v115.65,30.93 | v120.7,31.03 LED23.5 | 115.65,20.63 v115.65,26.05 v120.7,26.05 124.4,26.06 125.79,27.45 LED24.5
  Bottom 0.7: v115.65,30.93 v115.65,26.05 | v120.7,26.05 v120.7,31.03
RED_9  (via drill 0.9 pad 1)
  Top 0.4: U2.11 118.73,17.41 121.2,19.88
  Top 0.7: LED25.5 v130.85,31.03 | v135.95,30.98 LED26.5 | LED27.5 141.03,27.19 139.92,26.08 v135.95,26.09 v130.85,26.08 130.85,23.93 126.8,19.88 121.2,19.88
  Bottom 0.7: v130.85,31.03 v130.85,26.08 | v135.95,26.09 v135.95,30.98
RED_10  (via drill 0.9 pad 1)
  Top 0.4: U2.8 121.36,15.43 122.22,15.02
  Top 0.7: v151.15,31.43 LED29.5 | LED28.5 v146.1,30.98 | LED30.5 156.27,28.89 153.52,26.14 v151.21,26.14 v151.2,26.13 v146.1,26.13 146.1,23.94 142.32,20.16 134.72,20.16 129.56,15.02 122.22,15.02
  Bottom 0.7: v151.2,26.13 v151.15,31.43 | v146.1,30.98 v146.1,26.13
SCLK  (1 unrouted)
  Top 0.4: U1.4 49.12,12.74 50.18,11.7 | U2.4 118.7,12.78 119.66,10.28
  Top 0.7: 50.18,11.7 58.78,11.72 59.6,12.54 SL5.3 | SL3.3 136.48,10.32 134.7,8.54 120.38,8.54 119.66,10.28
SIN
  Top 0.4: U2.5 119.32,13.44 120.8,11
  Top 0.7: SL3.2 136.16,12.86 133.5,10.2 121.3,10.2 120.8,11
SOUT  (1 unrouted)
  Top 0.4: U2.24 105.14,13.44 104.56,12.86 | U1.24 34,13.42 32.8,11.94 | U1.5 50.62,13.42 51.1,12.94
  Top 0.7: 104.56,12.86 96.5,12.86 92.18,17.18 84.52,17.18 80.26,21.44 72.84,21.44 68.56,17.16 60.04,17.16 55.82,12.94 51.1,12.94 | 32.8,11.94 SL4.1
VCC  (via drill 0.5, 0.5 pad 1.2)
  Top 0.4: 109.78,9.66 U2.28 | U1.28 37.72,9.36 | Q5.8 Q5.7 11.5,8.02
  Top 0.7: Q4.3 11.5,16.14 11.5,13.6 | 11.5,13.6 11.5,8.02 | Q4.1 11.5,13.6 | Q5.3 Q5.2 Q5.1 Q5.8
  Top 1: Q5.1 18.09,2.71 39.96,2.69 | 37.72,9.36 39.94,9.36 39.96,2.69 | v109.78,7.68 109.78,9.66 | v109.78,3.84 109.78,2.67 89.96,2.67 | IC1.OUT 89.96,2.67 | 89.96,2.67 v89.96,1.2 | 39.96,2.69 89.96,2.67
  Bottom 0.7: v89.96,1.2 C2.1
  Bottom 1: v109.78,3.84 v109.78,7.68
VCC+5V  (via drill 0.5 pad 1.2)
  Top 1: SL6.1 79.29,19.31 83.72,14.88 v86.26,14.88 89.97,14.88 IC1.IN
  Bottom 0.406: C1.1 86.28,18.06 v86.26,14.88
VPRG  (via drill 0.5 pad 1.2)  (1 unrouted)
  Top 0.4: U1.6 52.94,14.06 v53.36,14.48 | U2.6 120.12,14.1 121.92,11.86
  Top 0.7: SL5.4 61.21,15.07 v60.68,14.52 | 121.92,11.86 132.54,11.86 136.08,15.4 SL3.1
  Bottom 0.7: v53.36,14.48 v60.68,14.52
XERR  (via drill 0.5 pad 1.2)  (1 unrouted)
  Top 0.4: U1.23 v31.72,14.08
XLAT  (1 unrouted)
  Top 0.4: U2.3 117.58,12.12 118.36,9.46 | 48.86,10.46 47.2,12.12 U1.3
  Top 0.7: SL5.2 49.33,9.99 48.86,10.46 | SL3.4 136.8,7.78 135.66,6.64 119.16,6.64 118.36,9.46
(copper drawn outside any net)
  shapes: Top area x7